# EAGLE design barbi_pozoriste_slave_revb (EAGLE 5.00)
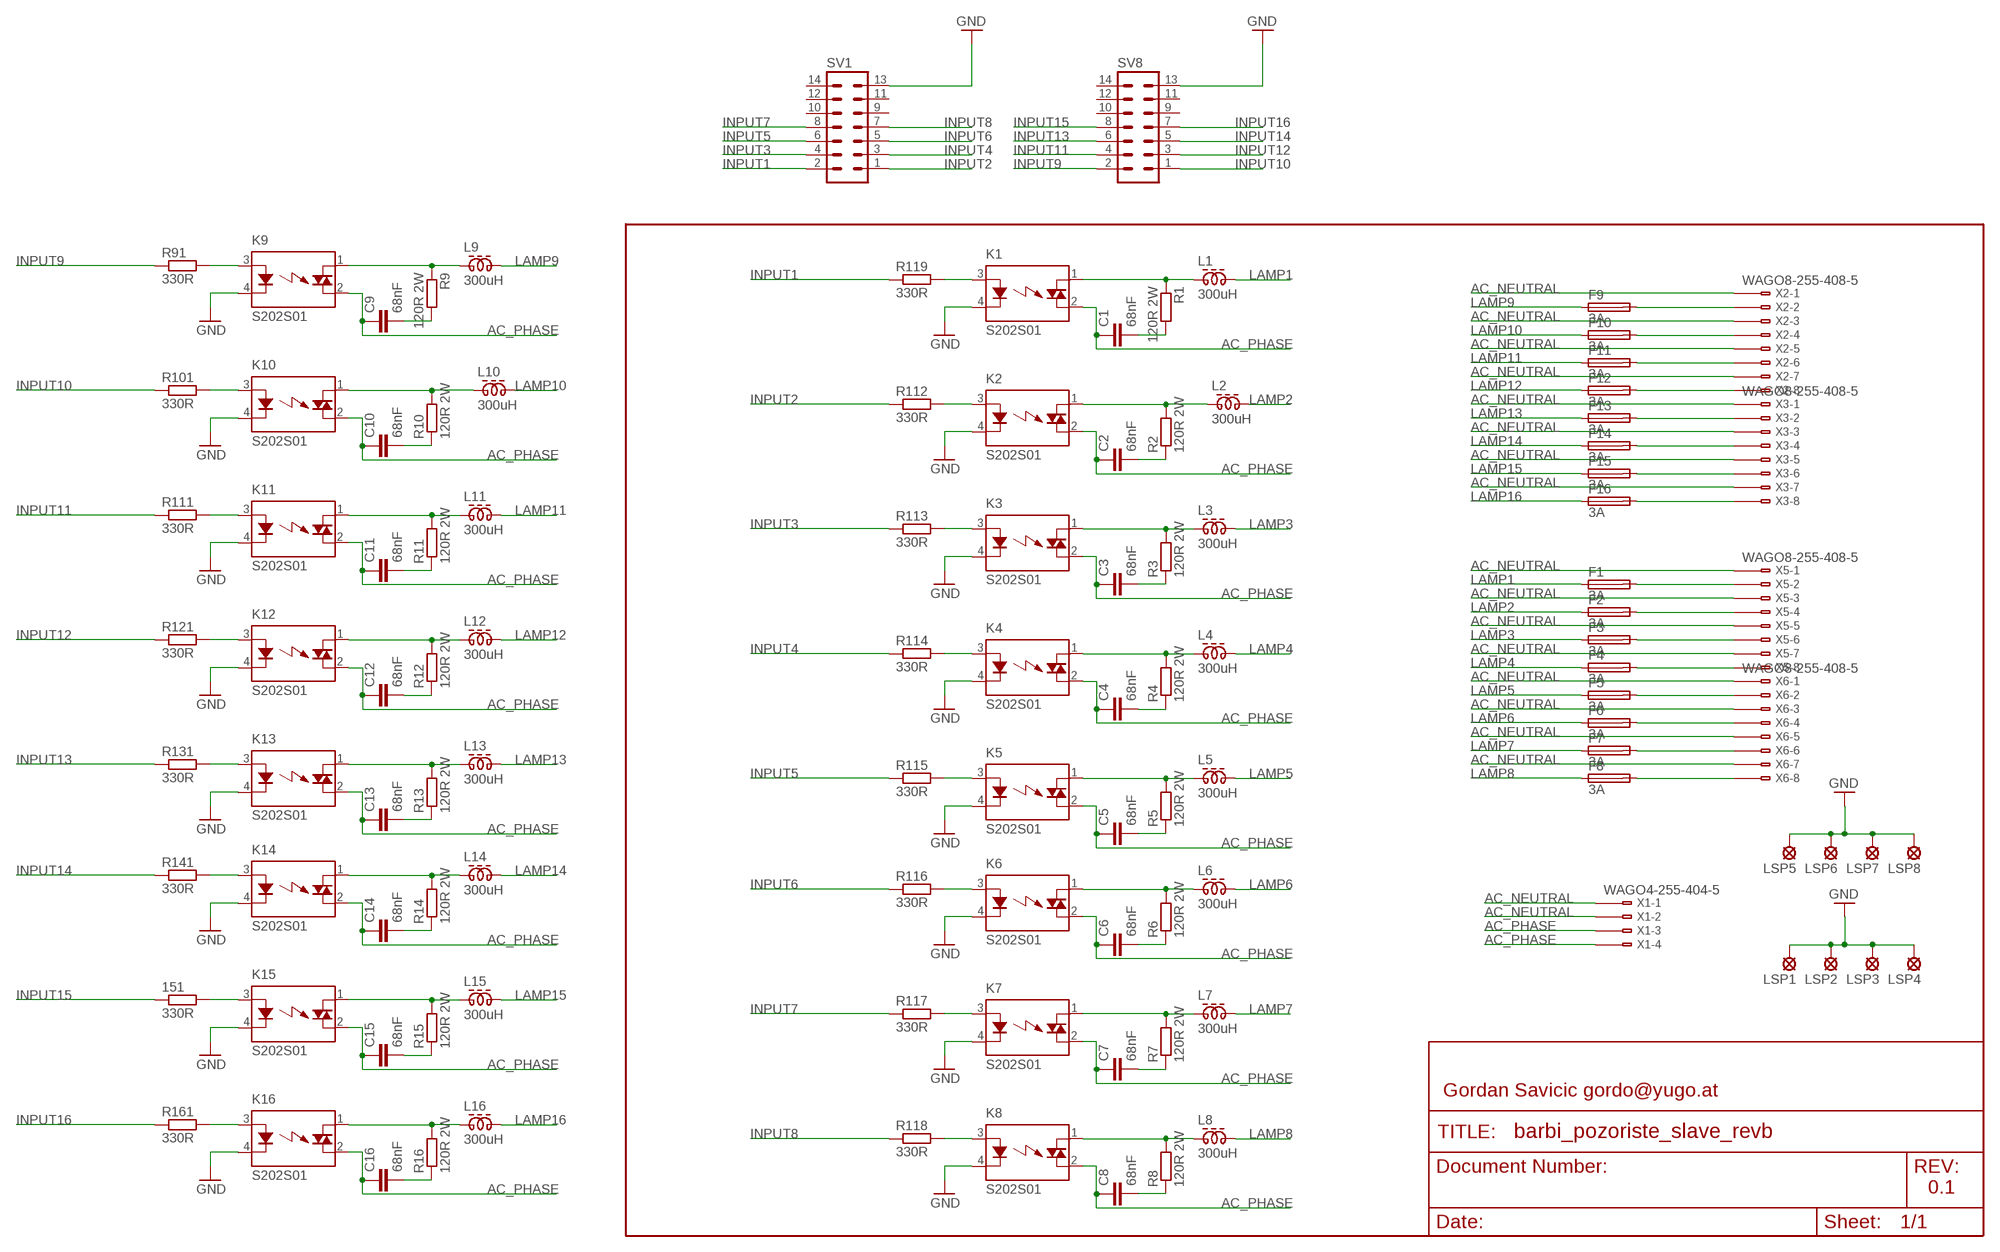
[diagram p0: schematic, sheet 1]

## Parts
151  330R  R-EU_M0805  [M0805]
C1  68nF  C-EU150-064X183  [C150-064X183]
C2  68nF  C-EU150-064X183  [C150-064X183]
C3  68nF  C-EU150-064X183  [C150-064X183]
C4  68nF  C-EU150-064X183  [C150-064X183]
C5  68nF  C-EU150-064X183  [C150-064X183]
C6  68nF  C-EU150-064X183  [C150-064X183]
C7  68nF  C-EU150-064X183  [C150-064X183]
C8  68nF  C-EU150-064X183  [C150-064X183]
C9  68nF  C-EU150-064X183  [C150-064X183]
C10  68nF  C-EU150-064X183  [C150-064X183]
C11  68nF  C-EU150-064X183  [C150-064X183]
C12  68nF  C-EU150-064X183  [C150-064X183]
C13  68nF  C-EU150-064X183  [C150-064X183]
C14  68nF  C-EU150-064X183  [C150-064X183]
C15  68nF  C-EU150-064X183  [C150-064X183]
C16  68nF  C-EU150-064X183  [C150-064X183]
F1  3A  SH22,5  [SH22,5]
F2  3A  SH22,5  [SH22,5]
F3  3A  SH22,5  [SH22,5]
F4  3A  SH22,5  [SH22,5]
F5  3A  SH22,5  [SH22,5]
F6  3A  SH22,5  [SH22,5]
F7  3A  SH22,5  [SH22,5]
F8  3A  SH22,5  [SH22,5]
F9  3A  SH22,5  [SH22,5]
F10  3A  SH22,5  [SH22,5]
F11  3A  SH22,5  [SH22,5]
F12  3A  SH22,5  [SH22,5]
F13  3A  SH22,5  [SH22,5]
F14  3A  SH22,5  [SH22,5]
F15  3A  SH22,5  [SH22,5]
F16  3A  SH22,5  [SH22,5]
K1  S202S01  [S102S01]
K2  S202S01  [S102S01]
K3  S202S01  [S102S01]
K4  S202S01  [S102S01]
K5  S202S01  [S102S01]
K6  S202S01  [S102S01]
K7  S202S01  [S102S01]
K8  S202S01  [S102S01]
K9  S202S01  [S102S01]
K10  S202S01  [S102S01]
K11  S202S01  [S102S01]
K12  S202S01  [S102S01]
K13  S202S01  [S102S01]
K14  S202S01  [S102S01]
K15  S202S01  [S102S01]
K16  S202S01  [S102S01]
L1  300uH  ZD60820512  [ZD6-2W5]
L2  300uH  ZD60820512  [ZD6-2W5]
L3  300uH  ZD60820512  [ZD6-2W5]
L4  300uH  ZD60820512  [ZD6-2W5]
L5  300uH  ZD60820512  [ZD6-2W5]
L6  300uH  ZD60820512  [ZD6-2W5]
L7  300uH  ZD60820512  [ZD6-2W5]
L8  300uH  ZD60820512  [ZD6-2W5]
L9  300uH  ZD60820512  [ZD6-2W5]
L10  300uH  ZD60820512  [ZD6-2W5]
L11  300uH  ZD60820512  [ZD6-2W5]
L12  300uH  ZD60820512  [ZD6-2W5]
L13  300uH  ZD60820512  [ZD6-2W5]
L14  300uH  ZD60820512  [ZD6-2W5]
L15  300uH  ZD60820512  [ZD6-2W5]
L16  300uH  ZD60820512  [ZD6-2W5]
LSP1  MCS08  [MCS08]
LSP2  MCS08  [MCS08]
LSP3  MCS08  [MCS08]
LSP4  MCS08  [MCS08]
LSP5  MCS08  [MCS08]
LSP6  MCS08  [MCS08]
LSP7  MCS08  [MCS08]
LSP8  MCS08  [MCS08]
R1  120R 2W  R-EU_0411/12  [0411/12]
R2  120R 2W  R-EU_0411/12  [0411/12]
R3  120R 2W  R-EU_0411/12  [0411/12]
R4  120R 2W  R-EU_0411/12  [0411/12]
R5  120R 2W  R-EU_0411/12  [0411/12]
R6  120R 2W  R-EU_0411/12  [0411/12]
R7  120R 2W  R-EU_0411/12  [0411/12]
R8  120R 2W  R-EU_0411/12  [0411/12]
R9  120R 2W  R-EU_0411/12  [0411/12]
R10  120R 2W  R-EU_0411/12  [0411/12]
R11  120R 2W  R-EU_0411/12  [0411/12]
R12  120R 2W  R-EU_0411/12  [0411/12]
R13  120R 2W  R-EU_0411/12  [0411/12]
R14  120R 2W  R-EU_0411/12  [0411/12]
R15  120R 2W  R-EU_0411/12  [0411/12]
R16  120R 2W  R-EU_0411/12  [0411/12]
R91  330R  R-EU_M0805  [M0805]
R101  330R  R-EU_M0805  [M0805]
R111  330R  R-EU_M0805  [M0805]
R112  330R  R-EU_M0805  [M0805]
R113  330R  R-EU_M0805  [M0805]
R114  330R  R-EU_M0805  [M0805]
R115  330R  R-EU_M0805  [M0805]
R116  330R  R-EU_M0805  [M0805]
R117  330R  R-EU_M0805  [M0805]
R118  330R  R-EU_M0805  [M0805]
R119  330R  R-EU_M0805  [M0805]
R121  330R  R-EU_M0805  [M0805]
R131  330R  R-EU_M0805  [M0805]
R141  330R  R-EU_M0805  [M0805]
R161  330R  R-EU_M0805  [M0805]
SV1  ML14  [ML14]
SV8  ML14  [ML14]
X1  WAGO4-255-404-5  [255-404-5]
X2  WAGO8-255-408-5  [255-408-5]
X3  WAGO8-255-408-5  [255-408-5]
X5  WAGO8-255-408-5  [255-408-5]
X6  WAGO8-255-408-5  [255-408-5]

## Nets
AC_NEUTRAL: X1.B1(-1:B1) X1.B2(-2:B1) X2.B1(-1:B1) X2.B3(-3:B1) X2.B5(-5:B1) X2.B7(-7:B1) X3.B1(-1:B1) X3.B3(-3:B1) X3.B5(-5:B1) X3.B7(-7:B1) X5.B1(-1:B1) X5.B3(-3:B1) X5.B5(-5:B1) X5.B7(-7:B1) X6.B1(-1:B1) X6.B3(-3:B1) X6.B5(-5:B1) X6.B7(-7:B1)
AC_PHASE: C1.1 C2.1 C3.1 C4.1 C5.1 C6.1 C7.1 C8.1 C9.1 C10.1 C11.1 C12.1 C13.1 C14.1 C15.1 C16.1 K1.2(DS2) K2.2(DS2) K3.2(DS2) K4.2(DS2) K5.2(DS2) K6.2(DS2) K7.2(DS2) K8.2(DS2) K9.2(DS2) K10.2(DS2) K11.2(DS2) K12.2(DS2) K13.2(DS2) K14.2(DS2) K15.2(DS2) K16.2(DS2) X1.B3(-3:B1) X1.B4(-4:B1)
GND: K1.4(K) K2.4(K) K3.4(K) K4.4(K) K5.4(K) K6.4(K) K7.4(K) K8.4(K) K9.4(K) K10.4(K) K11.4(K) K12.4(K) K13.4(K) K14.4(K) K15.4(K) K16.4(K) LSP1.MP LSP2.MP LSP3.MP LSP4.MP LSP5.MP LSP6.MP LSP7.MP LSP8.MP SV1.13 SV8.13
INPUT1: R119.1 SV1.2
INPUT2: R112.1 SV1.1
INPUT3: R113.1 SV1.4
INPUT4: R114.1 SV1.3
INPUT5: R115.1 SV1.6
INPUT6: R116.1 SV1.5
INPUT7: R117.1 SV1.8
INPUT8: R118.1 SV1.7
INPUT9: R91.1 SV8.2
INPUT10: R101.1 SV8.1
INPUT11: R111.1 SV8.4
INPUT12: R121.1 SV8.3
INPUT13: R131.1 SV8.6
INPUT14: R141.1 SV8.5
INPUT15: 151.1 SV8.8
INPUT16: R161.1 SV8.7
LAMP1: F1.1 L1.2
LAMP2: F2.1 L2.2
LAMP3: F3.1 L3.2
LAMP4: F4.1 L4.2
LAMP5: F5.1 L5.2
LAMP6: F6.1 L6.2
LAMP7: F7.1 L7.2
LAMP8: F8.1 L8.2
LAMP9: F9.1 L9.2
LAMP10: F10.1 L10.2
LAMP11: F11.1 L11.2
LAMP12: F12.1 L12.2
LAMP13: F13.1 L13.2
LAMP14: F14.1 L14.2
LAMP15: F15.1 L15.2
LAMP16: F16.1 L16.2
N$1: K2.1(DS1) L2.1 R2.2
N$2: K1.1(DS1) L1.1 R1.1
N$3: C1.2 R1.2
N$4: C2.2 R2.1
N$5: F4.2 X5.B8(-8:B1)
N$6: K3.1(DS1) L3.1 R3.2
N$8: C3.2 R3.1
N$9: F1.2 X5.B2(-2:B1)
N$10: F2.2 X5.B4(-4:B1)
N$11: C4.2 R4.1
N$12: K4.1(DS1) L4.1 R4.2
N$13: K5.1(DS1) L5.1 R5.2
N$15: C5.2 R5.1
N$16: F3.2 X5.B6(-6:B1)
N$17: K6.1(DS1) L6.1 R6.2
N$18: C6.2 R6.1
N$19: F5.2 X6.B2(-2:B1)
N$20: F8.2 X6.B8(-8:B1)
N$21: C7.2 R7.1
N$22: K7.1(DS1) L7.1 R7.2
N$23: K8.1(DS1) L8.1 R8.2
N$24: C8.2 R8.1
N$25: F7.2 X6.B6(-6:B1)
N$26: F6.2 X6.B4(-4:B1)
N$27: K2.3(A) R112.2
N$28: K3.3(A) R113.2
N$29: K4.3(A) R114.2
N$30: K5.3(A) R115.2
N$31: K6.3(A) R116.2
N$32: K7.3(A) R117.2
N$33: K8.3(A) R118.2
N$34: K1.3(A) R119.2
N$36: K10.3(A) R101.2
N$38: K11.3(A) R111.2
N$40: K12.3(A) R121.2
N$42: K13.3(A) R131.2
N$44: K14.3(A) R141.2
N$46: 151.2 K15.3(A)
N$48: K16.3(A) R161.2
N$50: K9.3(A) R91.2
N$59: K9.1(DS1) L9.1 R9.1
N$60: C9.2 R9.2
N$61: K10.1(DS1) L10.1 R10.2
N$62: C10.2 R10.1
N$63: K11.1(DS1) L11.1 R11.2
N$64: C11.2 R11.1
N$65: C12.2 R12.1
N$66: K12.1(DS1) L12.1 R12.2
N$67: K13.1(DS1) L13.1 R13.2
N$68: C13.2 R13.1
N$69: K14.1(DS1) L14.1 R14.2
N$70: C14.2 R14.1
N$71: C15.2 R15.1
N$72: K15.1(DS1) L15.1 R15.2
N$73: K16.1(DS1) L16.1 R16.2
N$74: C16.2 R16.1
N$139: F12.2 X2.B8(-8:B1)
N$140: F9.2 X2.B2(-2:B1)
N$141: F10.2 X2.B4(-4:B1)
N$142: F11.2 X2.B6(-6:B1)
N$143: F13.2 X3.B2(-2:B1)
N$144: F16.2 X3.B8(-8:B1)
N$145: F15.2 X3.B6(-6:B1)
N$146: F14.2 X3.B4(-4:B1)
Unconnected: SV1.9 SV1.10 SV1.11 SV1.12 SV1.14 SV8.9 SV8.10 SV8.11 SV8.12 SV8.14 X1.A1(-1:A1) X1.A2(-2:A1) X1.A3(-3:A1) X1.A4(-4:A1) X2.A1(-1:A1) X2.A2(-2:A1) X2.A3(-3:A1) X2.A4(-4:A1) X2.A5(-5:A1) X2.A6(-6:A1) X2.A7(-7:A1) X2.A8(-8:A1) X3.A1(-1:A1) X3.A2(-2:A1) X3.A3(-3:A1) X3.A4(-4:A1) X3.A5(-5:A1) X3.A6(-6:A1) X3.A7(-7:A1) X3.A8(-8:A1) X5.A1(-1:A1) X5.A2(-2:A1) X5.A3(-3:A1) X5.A4(-4:A1) X5.A5(-5:A1) X5.A6(-6:A1) X5.A7(-7:A1) X5.A8(-8:A1) X6.A1(-1:A1) X6.A2(-2:A1) X6.A3(-3:A1) X6.A4(-4:A1) X6.A5(-5:A1) X6.A6(-6:A1) X6.A7(-7:A1) X6.A8(-8:A1)

## Notes on the sheet
- Gordan Savicic gordo@yugo.at
- 0.1

## Library data of the parts
151 R1-R16 R91 R101 R111-R119 R121 R131 R141 R161 = rcl:R-EU_: RESISTOR, European symbol
C1-C16 = rcl:C-EU: CAPACITOR, European symbol
F1-F16 = fuse:SH22,5: FUSE HOLDER grid 22,5 mm, OGN0031 8201, Schurter (Buerklin)
K1-K16 = relay:S?*: Low Height Type Solid State Relays SHARP Source: 162574-da-01-en-S202T02_Solid_State_Relais.pdf Source: http://sharp-world.com .. s102s11_e.pdf
L1-L16 = inductor-neosid:ZD60820512: WIDE-BAND CHOKE 2.5 windings
LSP1-LSP8 = solpad:MCS08: SOLDER PAD MC S0,8, drill 1.2 mm, distributor Buerklin, 08F130
SV1 SV8 = con-ml:ML14: HARTING
X1 = con-wago:WAGO4-: WAGO Cage Clamp
X2 X3 X5 X6 = con-wago:WAGO8-: WAGO Cage Clamp

## Board
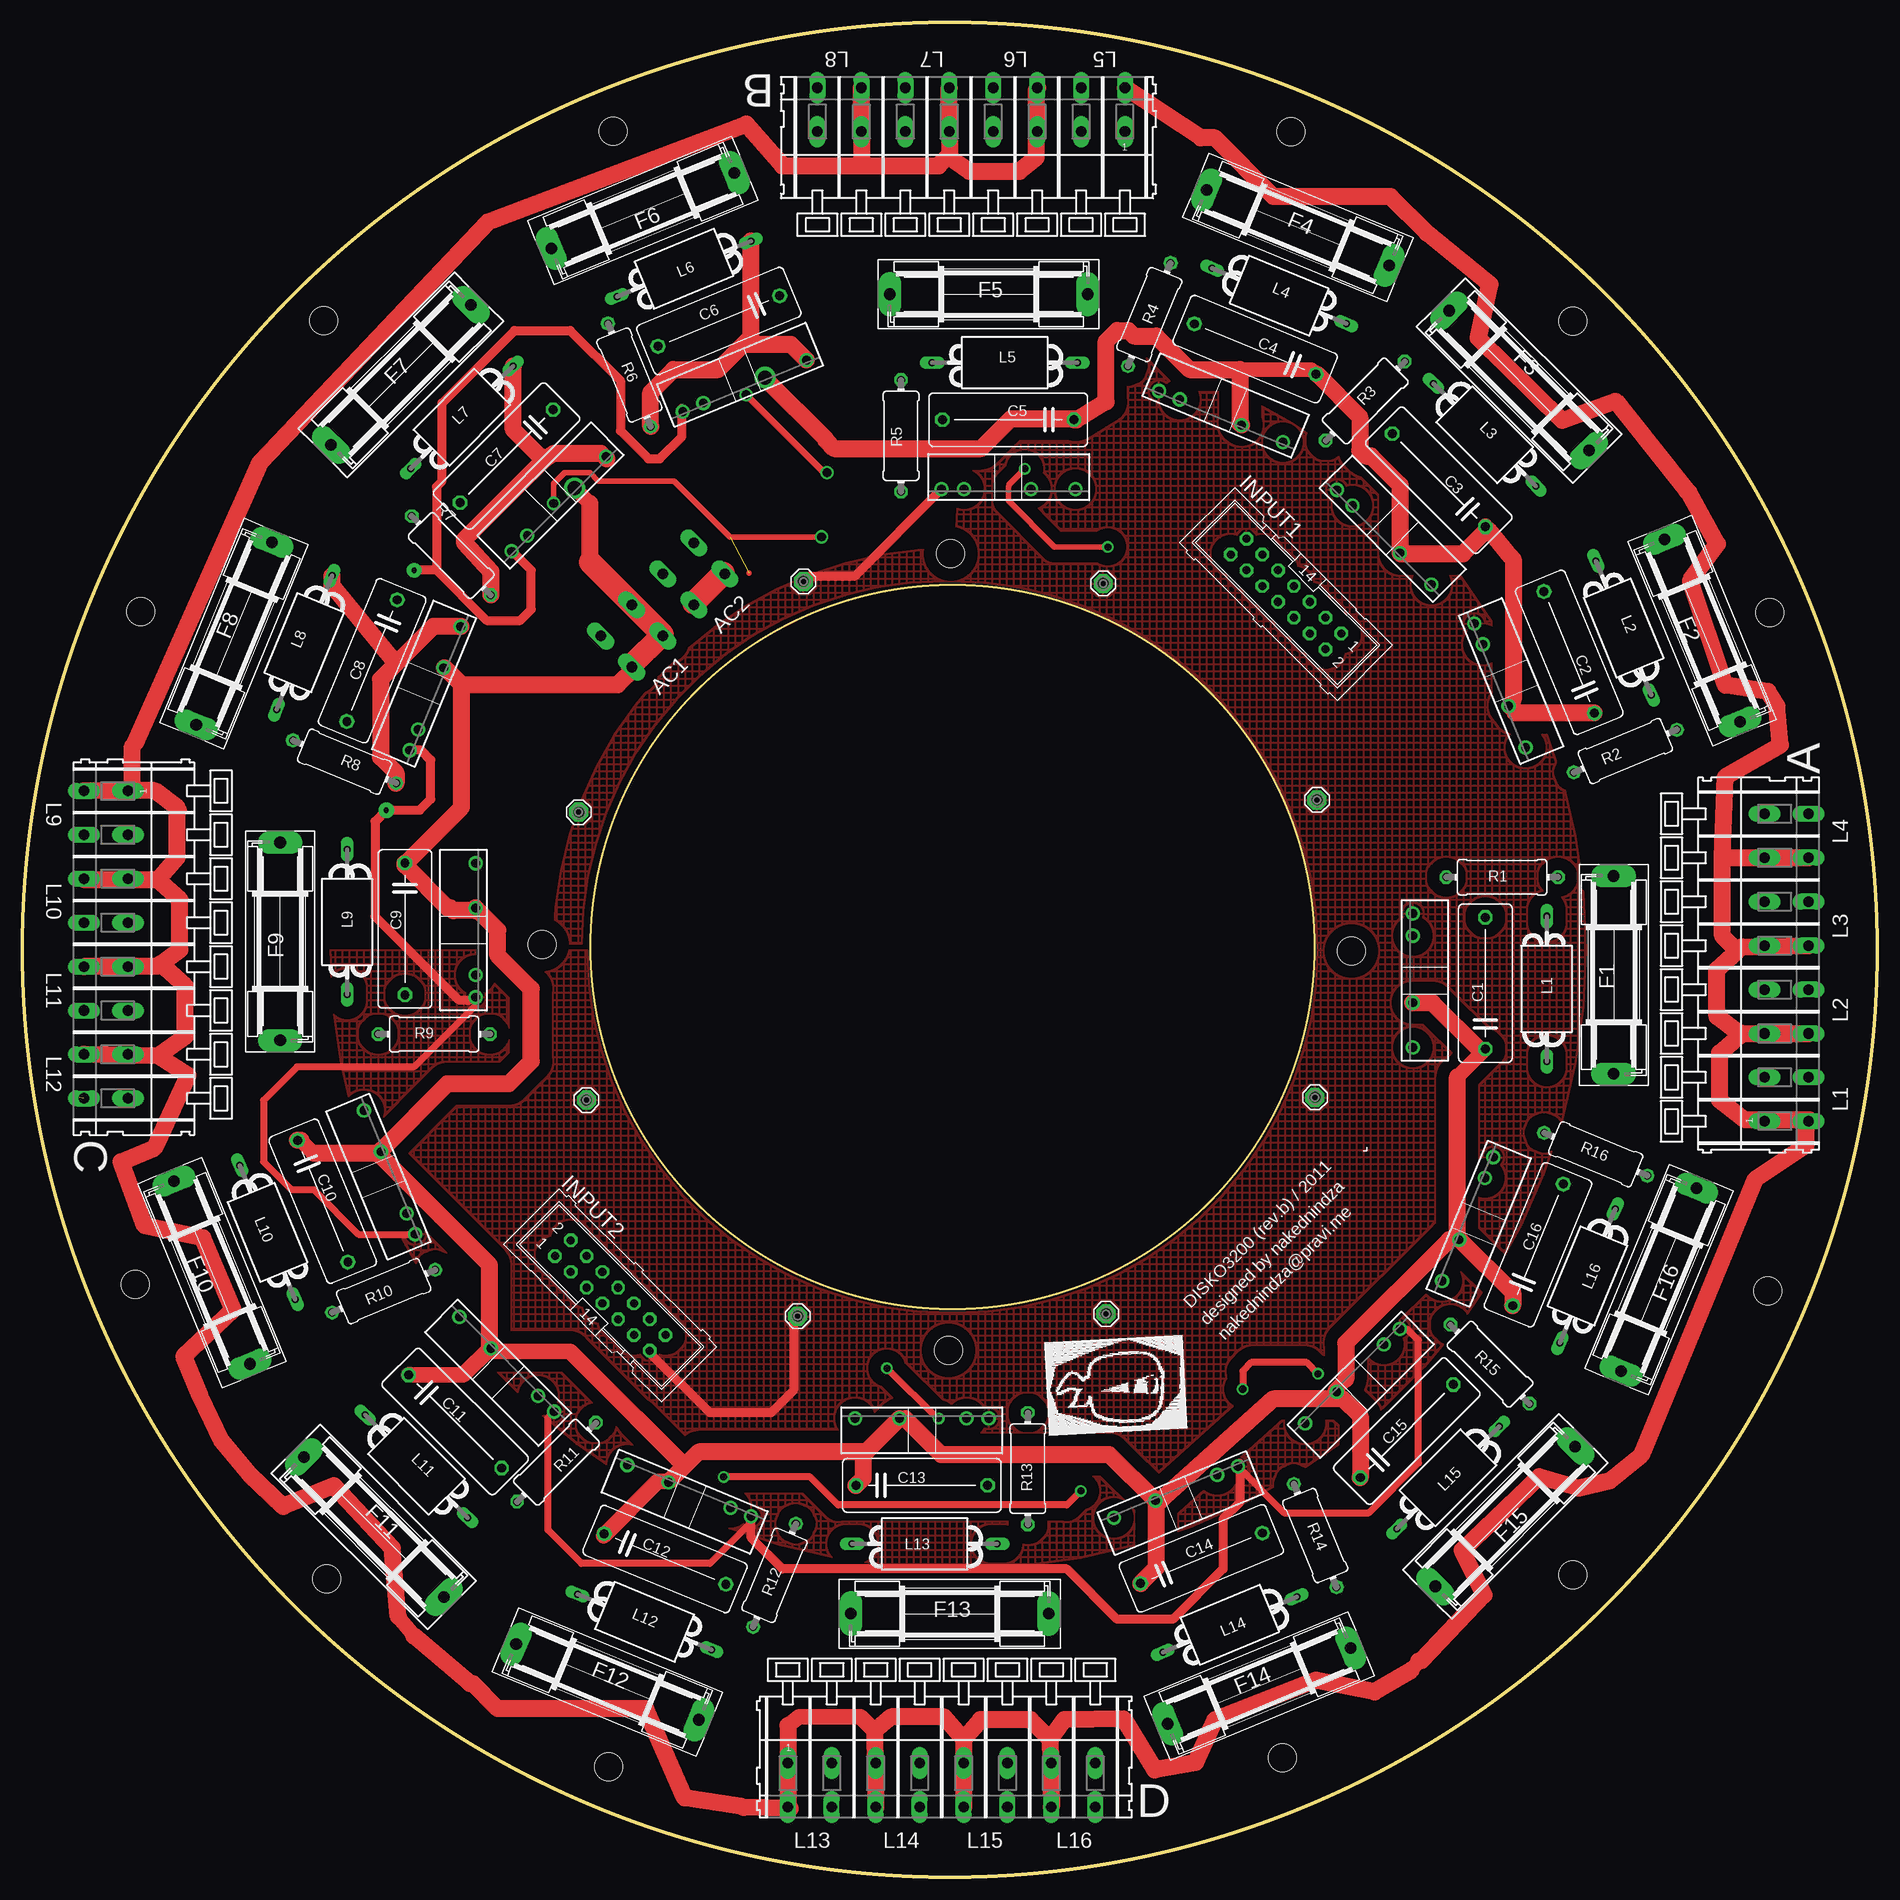
[diagram p1: board, top side]
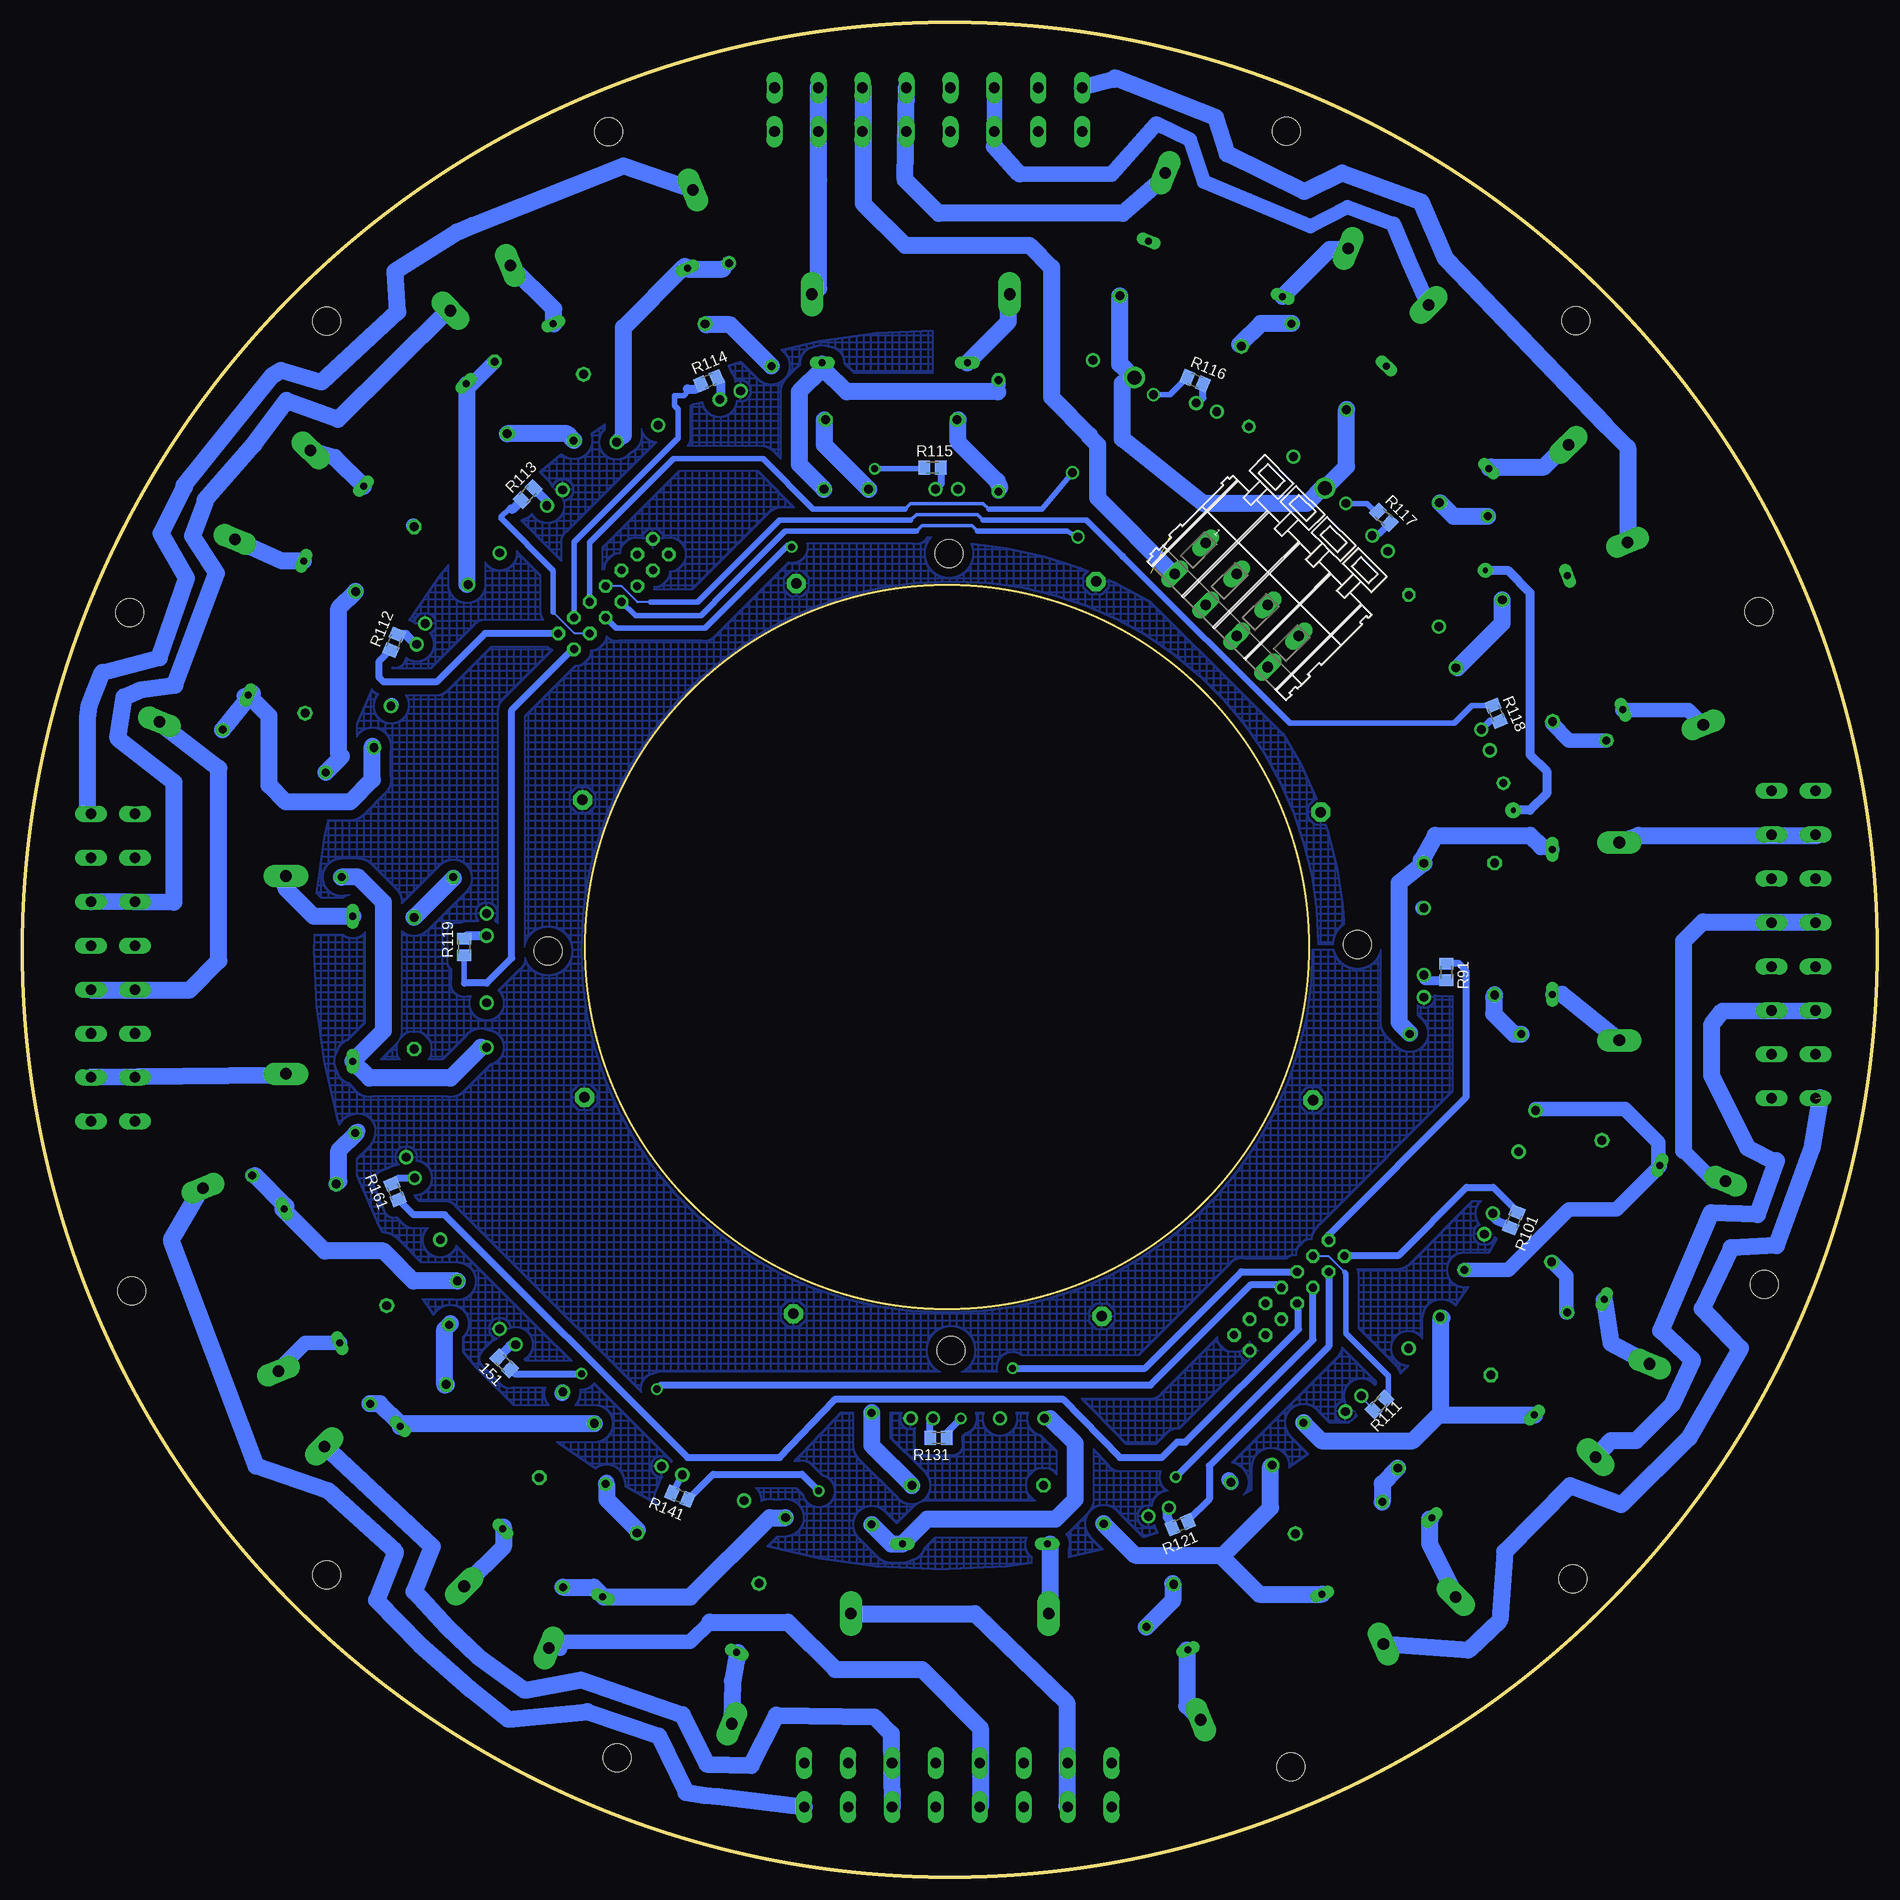
[diagram p2: board, bottom side, seen from below]

No outline drawn. Coordinates in mm, seen from the top.
Copper layers (1*16): Top 0.035mm / dielectric 1.5mm / Bottom 0.035mm
Design rules "SparkFun": minimum track width 8mil, minimum drill 20mil, track to track 8mil, track to pad 8mil, pad to pad 8mil, via to via 8mil, smd to smd 8mil, copper to edge 10mil, drill to drill 8mil, minimum pad ring 12mil, minimum via ring 10mil, stop-mask expansion 4mil, vias tented up to drill 25mil, thermal gap 10mil
Holes 3.2 mm at -46.41,0.59 45.7,-0.16 -0.13,-45.59 0.11,45.06 -92.06,38.48 93.09,-38.83 -38.86,-92.99 37.87,-91.95 -38.32,93.13 38.83,93.13 -92.7,-38.11 93.34,38.35 -71.23,71.61 -70.9,-71.57 70.9,-71.14 70.94,71.52
Milling: area -40.9,-40.9 to 41.5,41.5; area -105.4,-105.4 to 105.4,105.4; area -105.6,-105.6 to 105.6,105.6

### Footprints (pad centres in the part's own frame; a part is rotated, then mirrored left to right if it is on the bottom)
M0805 = smd 1.3 x 1.6: 1 -0.95,0; 2 0.95,0
C150-064X183 = drill 1.016 octagon: 1 -7.493,0; 2 7.493,0
SH22,5 = drill 1.321 pad 2.54 long: 1 -11.252,0; 2 11.252,0
S102S01 = drill 1 round: 1 -7.62,0; 2 -2.54,0; 3 5.08,0; 4 7.62,0
ZD6-2W5 = drill 0.8 long: 1 -8.255,0; 2 8.255,0
MCS08 = drill 1.194 pad 2.159 octagon: MP 0,0
0411/12 = drill 0.914 octagon: 1 -6.35,0; 2 6.35,0
ML14 = drill 0.914 octagon: 1 -7.62,-1.27; 2 -7.62,1.27; 3 -5.08,-1.27; 4 -5.08,1.27; 5 -2.54,-1.27; 6 -2.54,1.27; 7 0,-1.27; 8 0,1.27; 9 2.54,-1.27; 10 2.54,1.27; 11 5.08,-1.27; 12 5.08,1.27; 13 7.62,-1.27; 14 7.62,1.27
255-404-5 = drill 1.2 long: A1 -7.5,0; A2 -2.5,0; A3 2.5,0; A4 7.5,0; B1 -7.5,-5; B2 -2.5,-5; B3 2.5,-5; B4 7.5,-5
255-408-5 = drill 1.2 long: A1 -17.5,0; A2 -12.5,0; A3 -7.5,0; A4 -2.5,0; A5 2.5,0; A6 7.5,0; A7 12.5,0; A8 17.5,0; B1 -17.5,-5; B2 -12.5,-5; B3 -7.5,-5; B4 -2.5,-5; B5 2.5,-5; B6 7.5,-5; B7 12.5,-5; B8 17.5,-5

### Placement (x,y rotation side)
151  50.71,-47.08 135 bottom
C1  60.96,-3.81 90 top
C2  70.5,33.85 112.5 top
C3  55.66,53.43 135 top
C4  34.76,68.36 157.5 top
C5  6.65,60.32 180 top
C6  -26.28,71.56 202.5 top
C7  -50.44,56.18 225 top
C8  -65.75,32.9 247.5 top
C9  -62.01,2.37 270 top
C10  -71.36,-28.62 292.5 top
C11  -56.29,-53.7 315 top
C12  -32.41,-69.34 337.5 top
C13  -3.17,-60.96 0 top
C14  28.64,-69.26 22.5 top
C15  52.01,-54.78 45 top
C16  66.95,-33.58 67.5 top
F1  75.56,-2.86 270 top
F2  85.64,36.33 292.5 top
F3  64.79,64.78 135 top
F4  39.61,82.19 157.5 top
F5  4.43,74.61 0 top
F6  -34.92,84.12 22.5 top
F7  -62.45,65.42 45 top
F8  -81.45,35.98 67.5 top
F9  -76.2,0.95 90 top
F10  -83.97,-36.74 112.5 top
F11  -65.55,-65.69 135 top
F12  -38.96,-83.33 157.5 top
F13  0,-75.56 0 top
F14  35.22,-83.79 22.5 top
F15  63.23,-64.49 45 top
F16  80.7,-37.55 67.5 top
K1  52.7,-3.49 90 top
K2  62.63,30.07 112.5 top
K3  49.44,46.96 135 top
K4  30.86,60.69 157.5 top
K5  6.69,52.42 180 top
K6  -23.35,64.17 202.5 top
K7  -44.49,50.74 225 top
K8  -58.57,29.74 247.5 top
K9  -53.98,2.22 270 top
K10  -63.77,-25.33 292.5 top
K11  -50.43,-47.18 315 top
K12  -29.65,-61.57 337.5 top
K13  -3.17,-53.34 0 top
K14  25.74,-61.72 22.5 top
K15  45.83,-48.52 45 top
K16  58.95,-30.65 67.5 top
L1  67.94,-4.45 90 top
L2  76.69,36.61 112.5 top
L3  60.88,58.61 315 top
L4  37.49,74.42 337.5 top
L5  6.26,66.82 180 top
L6  -30.25,77.5 202.5 top
L7  -55.52,60.6 225 top
L8  -73.47,34.95 247.5 top
L9  -68.58,3.17 270 top
L10  -77.65,-32.16 292.5 top
L11  -60.7,-58.79 315 top
L12  -34.73,-76.49 337.5 top
L13  -2.86,-67.63 180 top
L14  31.87,-76.81 202.5 top
L15  56.7,-60.08 225 top
L16  72.58,-37.12 247.5 top
LSP1  -41.34,-17.12 0 top
LSP2  -17.31,-41.7 0 top
LSP3  17.8,-41.44 0 top
LSP4  41.58,-16.8 0 top
LSP5  -42.23,15.66 0 top
LSP6  -16.65,41.92 0 top
LSP7  17.46,41.69 0 top
LSP8  41.8,17.05 0 top
R1  62.87,8.26 180 top
R2  76.89,22.61 22.5 top
R3  47.29,62.45 45 top
R4  22.71,72.29 67.5 top
R5  -5.55,58.49 90 top
R6  -36.47,65.41 292.5 top
R7  -56.74,44.86 315 top
R8  -68.87,21.4 337.5 top
R9  -58.69,-9.6 180 top
R10  -64.43,-38.86 22.5 top
R11  -44.75,-58.33 45 top
R12  -19.95,-71.2 67.5 top
R13  8.89,-59.05 270 top
R14  41.6,-66.67 292.5 top
R15  61.49,-47.18 315 top
R16  73.51,-23.28 337.5 top
R91  -56.52,-2.54 270 bottom
R101  -64.21,-30.75 247.5 bottom
R111  -48.9,-51.75 225 bottom
R112  63.23,35 67.5 bottom
R113  48.04,51.85 45 bottom
R114  27.43,64.75 22.5 bottom
R115  1.95,54.86 0 bottom
R116  -27.94,64.77 337.5 bottom
R117  -49.4,49.21 315 bottom
R118  -62.18,26.91 292.5 bottom
R119  55.24,0.32 90 bottom
R121  -26.23,-65.43 202.5 bottom
R131  1.27,-55.56 180 bottom
R141  30.72,-62.18 157.5 bottom
R161  63.14,-27.55 112.5 bottom
SV1  38.27,40.49 135 top
SV8  -38.64,-39.35 315 top
X1  -34.43,41.01 315 bottom
X2  -93.54,0.59 270 top
X3  -0.93,-92.56 0 top
X5  92.75,-2.03 90 top
X6  2.44,93.1 180 top

### Tracks (layer width: path | path; a pad name or v marks a point on that pad's centre or on a via)
AC_NEUTRAL
  Top 1.676: -87.95,16.19 -87.63,15.88 | -0.32,90.17 0,90.17 | -10.16,89.22 -10.16,89.38 -10,89.22 | -25.72,42.86 -25.64,42.78 X1.B1 | -29.13,39.45 X1.B2 | X3.B1 -18.16,-97.71 | 53.34,-80.96 52.54,-81.99 | -60.96,-78.11 -62.77,-75.91 | 84.14,52.07 83.87,52.24 | 10.16,98.11 | 10.16,98.11 X6.B3 | 9.84,97.79 10.16,98.11
  Top 1.778: -98.42,7.94 X2.B3 | -90.17,-1.91 -89.81,-1.64 -89.85,-1.59 | -18.73,-97.47 X3.B1 -18.41,-97.47 | -8.57,-88.9 -10.16,-87.31 -17.14,-87.31 -18.41,-88.27 | 97.47,-19.68 X5.B1 97.79,-19.37 | 90.17,-9.53 89.99,-9.68 89.85,-9.53 | 90.17,0.32 89.66,-0.14 89.53,0 | -10.16,89.22 -10,89.22 | -93.03,18.09 | -93.03,23.18 -92.71,23.5
  Top 1.93: -60.96,-78.11 -54.61,-83.5 -54.29,-83.5 -51.44,-86.36 -34.61,-86.36 -30.16,-96.52 -23.81,-97.47 -23.46,-97.6 -18.16,-97.71 | X2.B1 -93.03,18.09 -90.49,18.1 -87.95,16.19 -87.95,10.48 -90.17,7.94 | -90.17,7.94 -98.42,7.94 | -90.17,-1.91 X2.B5 | -89.81,-1.64 -87.63,0 -87.63,5.71 -90.17,7.94 | -90.17,-12.06 X2.B7 | -90.17,-12.06 -87,-9.84 -87,-4.13 -89.85,-1.59 | -90.17,-12.06 -86.68,-14.29 -90.49,-22.54 -94.3,-24.13 -91.6,-31.43 -85.02,-32.79 -81.55,-40.98 -87.16,-46.26 -85.31,-50.76 -82.87,-55.88 -79.69,-59.69 -75.85,-63.35 -70.11,-61 -63.43,-68.11 -62.77,-75.91 | X3.B3 -8.57,-88.9 -6.67,-87.31 -0.64,-87.31 1.59,-89.85 | -18.41,-88.27 -18.41,-97.47 | 1.59,-89.85 X3.B5 | 11.43,-89.85 X3.B7 | 11.43,-89.85 9.21,-87.63 3.49,-87.63 1.59,-89.85 | 11.43,-89.85 13.02,-87.63 19.8,-87.54 23.34,-93.34 27.97,-92.51 30.16,-87.64 41.69,-83.13 48.34,-84.46 52.54,-81.99 | 97.47,-19.68 97.47,-22.23 91.76,-26.04 78.74,-57.47 75.16,-60.4 71.58,-61.26 67.09,-59.94 58.3,-68.33 60.8,-73.44 53.68,-80.92 53.34,-80.96 | 90.17,-9.53 X5.B3 | 89.99,-9.68 87.63,-11.75 87.63,-17.14 90.49,-19.37 97.79,-19.37 | 90.17,0.32 X5.B5 | 89.66,-0.14 87.31,-2.22 87.31,-7.62 89.85,-9.53 | X5.B7 90.17,10.48 87.95,10.48 | 87.95,10.48 87.95,1.59 89.53,0 | X6.B5 0,90.17 2.22,88.58 7.94,88.58 9.84,90.17 9.84,97.79 | X6.B1 28.57,92.39 30.16,92.39 36.83,85.72 50.16,85.72 54.29,81.6 61.47,75.74 60.14,69.63 69.69,60.23 75.8,62.42 83.87,52.24 | 87.95,10.48 88.27,19.68 94.54,23.3 94.15,27.73 93.11,29.39 88.29,30.11 84.3,42.01 87.37,46.19 84.14,52.07 | X6.B7 -10,89.22 -1.27,89.22 -0.32,90.17 | -10.16,89.22 -19.05,89.22 -23.18,93.98 -52.56,82.83 -78.42,55.56 -92.71,23.5
  Top 1.93: -93.03,18.09 -93.03,23.18
  Top 2.54: -25.72,42.86 -29.13,39.45
  Bottom 1.676: -15.88,58.42 -15.92,58.47 -15.92,58.53 | -25.48,42.78 X1.B1 | 9.84,98.11 9.85,98.11 X6.B3
  Bottom 1.93: -15.92,58.53 -11.59,62.87 -11.59,77.63 -9.05,80.17 5.08,80.17 9.84,84.93 9.84,98.11 | -15.88,58.42 -16.83,57.47 -16.83,51.44 -25.48,42.78
AC_PHASE  (via drill 1.6 pad 1.02, 1.6 pad 1.93)
  Top 1.676: 57.78,-14.48 C1.1 60.2,-11.3 | K16.2 57.78,-32.8 | -9.53,-57.15 -9.84,-57.15 | K12.2 -32.07,-60.53 -32.07,-60.33 -31.75,-60.33 | -5.08,-53.34 K13.2 | K14.2 23.5,-62.79 23.89,-62.79 | C12.1 -39.21,-66.36 | 41.59,65.72 41.59,65.58 C4.1 | 14.46,60.33 13.97,60.33 | K3.2 51.31,45.09 | C3.1 60.96,48.26 | C3.1 61.28,47.81 | 60.96,47.62 C3.1 | 64.14,28.45 K2.2 64.33,26.99 | 63.82,44.77 64.14,44.45 | 73.34,26.99 73.34,26.95 C2.1 | 44.77,-51.12 44.03,-50.38 K15.2 43.97,-50.32 43.81,-50.16 45.09,-48.9 | 56.85,-33 K16.2 | K16.2 58.08,-33 | C4.1 41.82,65.5 | -72.39,-23.18 -73.87,-21.7 | -64.77,-23.5 -64.77,-23.18 -64.74,-23.14 K10.2 -64.74,-22.83 | -52.09,-45.38 -52.07,-45.4 | K11.2 -52.09,-45.38 | -52.09,-45.38 -52.39,-45.09 | -62.01,9.62 C9.1 | -56.83,4.76 -57.15,4.76 | -57.49,32.09 K8.2 | -36.2,32.38 X1.B4 -35.98,32.17 -35.88,32.07 | -40.96,50.8 K7.2 | -32.7,35.88 -32.66,35.84 X1.B3 | v-21,65.13 -21,64.99 | -14.1,58.09 -14.1,57.99 | 14.19,60.44 14.15,60.39 C5.1 | C4.1 41.68,65.51 41.15,66.04 33.02,66.04
  Top 1.778: -52.22,-45.24 -52.07,-45.09 | -52.22,-45.24 K11.2 -52.22,-45.57 -52.07,-45.72 -43.18,-45.72 -35.56,-53.34 | C11.1 -55.38,-48.4 -52.22,-45.24 | -39.33,-66.63 -39.37,-66.67 | -39.33,-66.63 C12.1 | -32.07,-60.53 -33.23,-60.53 -39.33,-66.63
  Top 1.93: 57.78,-32.8 57.78,-14.48 | K13.2 -9.53,-57.15 | -30.16,-58.74 -28.57,-57.15 -9.84,-57.15 -9.84,-60.13 C13.1 | -30.16,-58.74 -31.75,-60.33 | K14.2 18.17,-57.47 -0.95,-57.47 -5.08,-53.34 | C14.1 23.5,-70.35 23.5,-62.79 | C5.1 14.46,60.33 17.78,62.37 17.78,69.22 19.05,70.48 20.32,70.48 20.95,69.85 23.5,69.85 27.3,66.04 33.02,66.04 33.02,59.91 K4.2 | 51.31,45.09 58.42,45.09 60.96,47.62 | 61.28,47.81 63.82,44.77 | 64.14,44.45 64.14,28.45 | 64.33,26.99 73.34,26.99 | 23.89,-62.79 36.83,-51.12 44.77,-51.12 46.71,-53.06 C15.1 | 56.85,-33 45.09,-44.77 45.09,-48.9 | C16.1 64.08,-39 58.08,-33 | 60.2,-11.3 54.93,-6.03 K1.2 | K3.2 51.23,52.91 47.94,56.2 47.31,56.2 46.67,56.83 46.67,60.64 41.82,65.5 | -73.87,-21.7 C10.1 | -64.77,-23.18 -72.39,-23.18 | -64.77,-23.5 -52.39,-35.88 -52.39,-45.09 | -57.15,4.76 -62.01,9.62 | C9.1 -62.01,9.75 -55.56,16.19 -55.56,30.16 | -55.56,30.16 -57.49,32.09 | -55.56,30.16 -37.78,30.16 -35.88,32.07 | -40.96,44.13 -40.96,50.8 | -21,64.99 -14.1,58.09 | -14.1,57.99 -13.16,57.05 3.57,57.05 6.96,60.44 14.19,60.44 | -64.74,-22.83 -57.15,-15.24 -50.16,-15.24 -47.62,-12.7 -47.62,-4.45 -51.44,-0.64 -51.44,2.22 K9.2 -53.98,4.45 -56.52,4.45 -56.83,4.76 | -30.16,-58.74 -35.56,-53.34
  Top 2.54: -36.2,32.38 -32.7,35.88 -40.96,44.13
  Bottom 1.676: C3.1 61.08,48.26 | 14.29,60.33 C5.1 | K2.2 63.5,27.82 | K9.2 -53.82,4.76 | K7.2 | -20.95,65.09 v-21,65.13 K6.2 | -57.78,32.07 -57.76,32.09 K8.2 | -42.55,52.7 -42.69,52.56 K7.2 | -20.86,65.14 -20.77,65.23 | -20.86,65.14 K6.2 | -19.64,64.46 -20.86,65.14 | -20.86,65.14 | -20.86,65.14 -20.87,65.14 K6.2
  Bottom 1.778: K12.2 -31.75,-60.33 | K15.2 44.13,-50.48
  Bottom 1.93: K5.2 14.29,57.48 14.29,60.33 | C7.1 -45.15,54.99 K7.2 | C8.1 -62.88,37.16 -57.78,32.07 | -42.55,52.7 -40.64,50.8 -28.89,50.8 -19.64,58.15 -19.64,64.46 | C6.1 -19.36,66.64 -20.86,65.14
  other vias: -42.69,52.53
GND  (via drill 0.6 pad 1.68, 0.6 pad 1.78)
  Top 0.813: K14.4 38.11,-64.14 47.62,-64.14 53.34,-58.42 53.34,-44.45 52.07,-43.18 51.17,-43.18 | 51.17,-43.18 50.8,-43.18 | 51.17,-43.18 K15.4 | K11.4 -45.72,-53.24 -45.72,-66.04 -41.91,-69.85 -27.3,-69.85 -22.86,-65.41 -22.86,-64.74 K12.4 | K10.4 -60.87,-32.38 -67.31,-32.38 -72.39,-27.3 -74.93,-27.3 -78.11,-24.13 -78.11,-17.14 -74.3,-13.34 -60.96,-13.34 -53.98,-6.35 K9.4 -53.98,-5.08
  Top 1.016: SV8.13 -34.15,-45.86 -27.3,-52.7 -20.32,-52.7 -17.78,-50.16 -17.78,-42.55 -17.14,-41.91 -17.3,-41.75 LSP2.MP | K12.4 -22.61,-66.92 -19.05,-70.48 13.34,-70.48 19.05,-76.2 25.4,-76.2 31.11,-70.48 31.11,-64.77 33.02,-62.87 33.02,-58.42 32.78,-58.66 K14.4 | K7.4 -49.8,45.35 -47.62,43.18 -47.62,38.73 -48.9,37.47 -52.7,37.47 -58.42,43.18 | -58.42,43.18 -58.42,52.7 -57.78,53.34 -57.78,62.23 -49.53,70.48 -43.18,70.48 -37.47,64.77 -37.47,59.05 -34.29,55.88 -33.02,55.88 -30.48,58.42 -30.48,61.59 -30.39,61.5 K6.4 | -53.98,-5.08 -54.61,-5.71 -55.88,-5.71 -65.41,3.81 -65.41,14.61 v-64.14,15.88 -60.33,15.88 -59.05,17.14 -59.05,21.59 -60.17,22.7 K8.4 | -58.42,43.18 v-60.96,43.18 | K5.4 -0.93,52.41 -10.79,42.55 -15.88,42.55 -16.51,41.91 -16.52,41.92 LSP6.MP
  Bottom 0.813: LSP5.MP -42.55,15.88
  Bottom 1.016: v-60.96,43.18 -63.5,43.18 -66.04,40.64 -66.04,22.23 -67.94,20.32 -67.94,17.78 -66.04,15.88 v-64.14,15.88
  pour Bottom (isolate 1.016, hatched): -45.09,0.64 arc-90 1.91,46.35 1.91,70.48 arc-90 72.39,0 arc-90 1.91,-70.48 0,-70.48 arc-90 -70.48,0 -41.27,0 arc90 0,-41.27 0.64,-41.27 arc90 41.91,0 arc90 0,41.91 -0.64,41.91 arc90 -41.91,0.64
  pour Top (isolate 1.422, hatched): -45.09,0.64 arc-90 0.64,45.72 1.91,70.48 arc-90 72.39,0 arc-90 1.91,-70.48 0,-70.48 arc-90 -70.48,0 -41.27,0 arc90 0,-41.27 0.64,-41.27 arc90 41.91,0 arc90 0,41.91 -0.64,41.91 arc90 -41.91,0.64
INPUT1
  Bottom 0.61: 55.24,-3.81 R119.1
  Bottom 0.813: SV1.2 42.95,34.21 49.85,27.3 49.85,-0.95 52.7,-3.81 55.24,-3.81
INPUT2
  Bottom 0.61: 64.94,30.96 64.92,30.96
  Bottom 0.813: SV1.1 52.9,36 58.42,30.48 64.45,30.48 64.94,30.96 | R112.1 63.63,34.16 64.92,32.87 64.92,30.96
INPUT3
  Bottom 0.254: SV1.4 42.72,36 45.12,38.41
  Bottom 0.61: 51.05,49.1 51.07,49.09 | 45.12,38.41 45.12,43.17 51.05,49.1 | 49.9,50.16 50.16,50.16 51.05,49.28 51.05,49.1
  Bottom 1.016: R113.1 49.72,50.16 49.9,50.16
INPUT4
  Bottom 0.61: SV1.3 42.76,46.4 30.93,58.23 30.93,61.54 31.32,61.92 31.32,63.06 31.29,63.09 30.26,63.09 29.84,63.5 29.85,63.51 29.85,63.82
  Bottom 1.016: R114.1 28.87,63.82 29.85,63.82
INPUT5  (via drill 0.8 pad 1.02)
  Top 0.61: v8.55,54.75 6.72,52.92 6.72,52.76 6.67,52.7 6.67,51.12 11.94,45.84 v17.99,45.84
  Bottom 0.61: SV1.6 37.97,36.61 27.86,36.61 22.05,42.41 22.04,42.41 18.41,46.04 18.22,45.84 v17.99,45.84 | v8.55,54.75 6.39,54.75 6.38,54.73 3.05,54.73 2.93,54.86 | 2.93,54.86 3.17,54.61 | R115.1 2.93,54.86 | 2.93,54.86 2.54,55.24
INPUT6  (via drill 1 pad 1.02)
  Top 0.61: -14.29,54.29 v-13.97,54.29
  Top 0.813: v-23.18,63.18 -14.29,54.29
  Bottom 0.406: -4.45,50.16 -3.81,50.8 4.45,50.8 5.08,50.16
  Bottom 0.61: SV1.5 40.96,46.35 31.43,55.88 21.27,55.88 15.56,50.16 5.08,50.16 | v-13.97,54.29 -10.48,50.16 -4.45,50.16 | R116.1 -27.05,65.15 -25.08,63.18 v-23.18,63.18
INPUT7  (via drill 1 pad 1.02, 1 pad 1.27)  (1 unrouted)
  Top 0.61: v-45.09,50.8 -45.09,53.02 -43.81,54.29 -40.96,54.29 -40.01,53.34 -31.37,53.34 -25.02,46.99 v-14.61,46.99 | -22.83,42.89
  Bottom 0.406: -3.17,47.62 -2.54,48.26 3.17,48.26 3.81,47.62
  Bottom 0.61: SV1.8 37.32,39.59 35.76,38.03 28.31,38.03 26.76,39.58 | 26.76,39.58 26.76,39.59 | 26.76,39.58 26.76,39.6 18.73,47.62 3.81,47.62 | v-14.61,46.99 -13.34,47.62 -3.17,47.62 | R117.1 -48.41,49.88 -47.5,50.8 v-45.09,50.8
INPUT8
  Bottom 0.254: 33.43,39.55 35.53,39.55 37.35,41.37 39.08,41.37 39.1,41.35 39.14,41.39 SV1.7
  Bottom 0.406: -3.81,48.9 -3.17,49.53 3.81,49.53 4.45,48.9
  Bottom 0.61: 33.43,39.55 34.06,39.54 28.72,39.54 23.28,44.98 23.28,45.03 23.23,45.03 19.37,48.9 4.45,48.9 | -19.66,44.8 -19.68,44.77 -19.74,44.77 -38.72,25.79 -57.41,25.79 -59.44,27.81 -61.85,27.81 R118.1 | -19.66,44.8 | -19.66,44.8 -15.56,48.9 -3.81,48.9
  Bottom 0.813: -19.66,44.8
INPUT9
  Bottom 0.813: SV8.2 -43.13,-32.43 -58.74,-16.83 -58.74,-2.35 -57.91,-1.52 -56.52,-1.52 R91.1 -56.52,-1.91
INPUT10
  Bottom 0.61: -64.64,-29.84 -64.14,-29.34
  Bottom 0.813: SV8.1 -44.93,-34.76 -51.09,-34.76 -58.8,-27.05 -61.85,-27.05 -64.64,-29.84 -64.62,-29.87 R101.1
INPUT11
  Bottom 0.254: -44.95,-36.74 -44.95,-36.71 -43.09,-34.85 -41.4,-34.85 -41.34,-34.79 | -41.34,-34.79 -41.33,-34.79 | SV8.4 -41.34,-34.79
  Bottom 0.61: -44.95,-36.74 -45.09,-36.88 -45.09,-43.69 -49.91,-48.51 -49.91,-50.8 -49.63,-51.08 R111.1 -49.57,-50.76
INPUT12
  Bottom 0.813: SV8.3 -43.13,-45.13 -29.53,-58.74 -29.53,-62.55 -27.05,-65.02 -27.09,-65.07 R121.1
  Bottom 1.016: R121.1 -27.09,-65.09
INPUT13  (via drill 0.8 pad 1.02)
  Top 0.813: v-7.14,-47.62 -7.11,-47.62 -1.4,-53.34 v-1.27,-53.34
  Bottom 0.813: SV8.6 -33.19,-36.66 -22.23,-47.62 v-7.14,-47.62 | R131.1 0.32,-54.93 v-1.27,-53.34
INPUT14  (via drill 0.8 pad 1.02)
  Top 0.813: v-25.72,-60.01 -15.88,-60.01 -12.7,-63.18 13.34,-63.18 v14.92,-61.59
  Bottom 0.813: v14.92,-61.59 16.83,-59.69 26.92,-59.69 29.84,-62.61 29.85,-62.61 R141.1 | SV8.5 -41.34,-44.39 v-25.72,-60.01
INPUT15  (via drill 0.8 pad 1.02)
  Top 0.813: v41.91,-48.26 40.64,-46.99 34.29,-46.99 33.34,-47.94 v33.34,-50.01
  Bottom 0.61: 151.1 50.16,-47.62
  Bottom 0.813: v33.34,-50.01 32.86,-49.53 -22.86,-49.53 -34.29,-38.1 -37.47,-38.1 -37.78,-38.42 SV8.8 | 151.1 49.53,-48.26 v41.91,-48.26 | 151.1
  Bottom 1.016: 50.16,-47.62 | 151.1 50.16,-47.62 | 50.16,-47.62 50.11,-47.62
INPUT16
  Bottom 0.813: 13.17,-51.28 19.37,-57.78 29.84,-57.78 57.47,-30.16 61.02,-30.16 62.76,-28.43 R161.1 | 13.17,-51.28 13.02,-51.12 | 13.17,-51.28 13.18,-51.28 13.02,-51.12 | 13.17,-51.28 | 13.02,-51.12 -12.86,-51.12 -19.37,-57.78 -24.13,-57.78 -25.89,-56.03 -26.84,-56.03 -39.69,-43.18 -39.69,-40.01 -39.54,-40.15 SV8.7
LAMP1
  Bottom 1.93: F1.1 75.56,6.99 72.39,3.81 L1.2
LAMP2
  Bottom 1.676: 81.27,46.62 81.36,46.45 F2.1
  Bottom 1.93: L2.2 75.99,44.24 81.27,46.62
LAMP3
  Bottom 1.676: 66.67,52.7 66.72,52.75 L3.2
  Bottom 1.93: F3.1 69.98,56.01 66.72,52.75
LAMP4
  Bottom 1.676: 45.09,71.12 45.09,71.23 L4.2
  Bottom 1.93: F4.1 45.09,72.95 45.09,71.23
LAMP5
  Bottom 1.676: -6.67,74.93 -6.67,74.76 F5.1
  Bottom 1.93: L5.2 -6.67,71.48 -6.67,74.76
LAMP6
  Bottom 1.676: -45.4,79.69 -45.4,79.73 F6.1
  Bottom 1.93: L6.2 -43.23,79.69 -45.4,79.69
LAMP7
  Bottom 1.676: -70.48,57.78 -70.41,57.71 F7.1
  Bottom 1.778: L7.2 -61.59,54.93
  Bottom 1.93: -61.59,54.93 -67.63,54.93 -70.41,57.71
LAMP8
  Bottom 1.676: -76.61,27.3 -76.52,27.3 | L8.2 -76.61,27.3 | F8.1 -84.03,27.3 -76.61,27.3
  Bottom 1.778: L8.2 -76.83,27.3
LAMP9
  Bottom 1.676: L9.2 -69.71,-5.08
  Bottom 1.93: -69.71,-5.08 F9.1
LAMP10
  Bottom 1.676: -74.61,-39.69 -74.59,-39.69 L10.2 -74.49,-39.88
  Bottom 1.93: F10.1 -79.38,-46.99 -75.25,-44.77 -74.49,-39.88
LAMP11
  Bottom 1.676: -54.61,-64.77 -54.72,-64.77 L11.2
  Bottom 1.778: L11.2 -54.61,-64.77
  Bottom 1.93: F11.1 -54.61,-67.57 -54.61,-64.77
LAMP12
  Bottom 1.676: -26.99,-79.69 -27.07,-79.69 L12.2
  Bottom 1.93: F12.1 -26.99,-86.07 -26.99,-79.69
LAMP13
  Bottom 1.676: L13.2 -11.43,-67.63 | -11.43,-75.39 F13.1
  Bottom 1.93: -11.43,-67.63 -11.43,-75.39
LAMP14
  Bottom 1.676: 24.13,-80.01 24.17,-79.97 L14.2
  Bottom 1.93: F14.1 24.73,-83.24 24.13,-80.01
LAMP15
  Bottom 1.676: 55.27,-72.42 F15.1
  Bottom 1.778: L15.2 50.8,-65.72
  Bottom 1.93: 50.8,-65.72 50.8,-67.94 55.27,-72.42
LAMP16
  Bottom 1.676: F16.1 76.51,-47.95 76.52,-47.94 73.34,-44.77 69.53,-44.77
  Bottom 1.778: L16.2 69.53,-44.77
N$1
  Bottom 1.676: 65.72,23.18 65.69,23.18 K2.1
  Bottom 1.778: L2.1 80.33,28.89 79.38,29.21
  Bottom 1.93: 79.38,29.21 R2.2 | L2.1 77.47,26.6 77.47,18.73 75.56,16.83 68.26,16.83 65.72,19.37 65.72,23.18
N$2
  Bottom 1.676: K1.1 53.34,-11.11
  Bottom 1.93: 53.34,-11.11 56.83,-14.61 66.04,-14.61 L1.1 64.45,-9.21 64.45,5.4 67.31,8.26 R1.1
N$3
  Bottom 1.676: 56.52,8.13 R1.2
  Bottom 1.93: C1.2 56.52,8.13
N$4
  Bottom 1.676: 67.63,40.96 67.63,40.78 C2.2 | 69.53,22.23 69.45,22.23 69.22,21.99
  Bottom 1.93: R2.1 69.22,21.99 | 67.63,40.78 69.53,38.88 69.53,22.23
N$5
  Bottom 1.676: 87.12,52.63 87.15,52.86
  Bottom 1.778: X5.B8 98.11,15.56
  Bottom 1.93: F4.2 37.15,89.22 54.36,82.41 56.07,81.69 63.13,77.22 62.83,72.59 71.5,64.61 76.12,65.94 77.14,65.32 87.15,52.86 | 98.11,15.56 98.11,26.35 97.95,27.78 96.43,31.56 89.97,33.25 86.84,42.3 89.76,47.37 87.12,52.63
N$6
  Bottom 1.676: R3.2 54.59,64.14 54.93,64.14 54.93,64.33 L3.1 | 54.93,41.59 54.85,41.59 K3.1
  Bottom 1.93: 54.93,41.59 54.93,64.33
N$8
  Bottom 1.676: C3.2
  Bottom 1.93: R3.1 43.58,58.74 C3.2
N$9
  Bottom 1.778: F1.2 76.83,-14.29
  Bottom 1.93: 76.83,-14.29 X5.B2
N$10
  Bottom 1.676: X5.B4 97.65,-4.62
  Bottom 1.778: 90,25.75 F2.2 89.92,25.82
  Bottom 1.93: 89.92,25.82 83.19,20.64 83.19,-1.23 86.58,-4.62 97.65,-4.62
N$11
  Bottom 1.676: 27.73,71.12 C4.2
  Bottom 1.93: R4.1 24.98,71.12 27.73,71.12
N$12
  Bottom 1.676: 29.84,77.47 29.84,77.56 L4.1 29.84,77.59 29.84,77.79 30.16,77.79 | 25.83,77.47 R4.2 | K4.1 37.15,58.53
  Bottom 1.93: 29.84,77.47 25.83,77.47 | 37.15,58.53 37.15,70.8 30.16,77.79
N$13
  Bottom 1.676: R5.2 -5.48,63.5 | 14.29,66.04 14.29,66.67 14.37,66.67 L5.1 14.61,66.72 14.61,66.04
  Bottom 1.93: -5.48,63.5 11.75,63.5 14.29,66.04 | K5.1 17.14,55.26 17.14,63.5 14.61,66.04
N$15
  Bottom 1.676: R5.1 -5.71,52.61 | -0.95,60.33 C5.2
  Bottom 1.93: -5.71,52.61 -5.4,53.34 -0.95,57.78 -0.95,60.33
N$16
  Bottom 1.676: 84.69,51.03 84.77,51.12 | 56.77,72.99 F3.2 57.01,72.84
  Bottom 1.93: X5.B6 88.27,5.4 88.27,19.05 94.67,24.05 93.95,28.77 92,29.59 88.2,30.11 83.43,42.84 86.17,47.09 84.69,51.03 | 84.77,51.12 79.22,57.47 75.49,62.5 69.62,60.38 57.01,72.84
N$17
  Top 1.676: -23.34,68.74 -23.18,68.9 | -16.31,67.11 K6.1 | -23.5,68.9 -23.34,68.74 | -23.34,68.74
  Top 1.93: R6.2 -34.04,63.43 -31.43,66.04 -26.35,66.04 -23.5,68.9 -22.63,69.77 L6.1 | -23.18,68.9 -18.1,68.9 -16.31,67.11
N$18
  Bottom 1.676: -33.02,68.87 -33.02,68.9 -33.2,68.71 C6.2
  Bottom 1.93: R6.1 -35.4,71.28 -33.02,68.9
N$19
  Bottom 1.676: F5.2 15.56,74.61 14.92,75.25
  Bottom 1.778: 14.92,98.42 X6.B2
  Bottom 1.93: 14.92,98.42 14.92,87.63 14.92,75.25
N$20
  Bottom 1.676: -18.76,99.22 -18.73,99.06
  Bottom 1.778: -74.61,59.69 -77.15,57.16
  Bottom 1.93: -74.61,59.69 -56.48,78.57 -53.66,85.09 -44.64,88.39 -40.36,86.28 -31.58,90.57 -30.27,94.7 -18.76,99.22 | -18.73,99.06 X6.B8 | -77.15,57.16 F8.2
N$21
  Bottom 1.676: C7.2 -55.8,50.88
  Bottom 1.93: R7.1 -57.33,49.35 -55.8,50.88
N$22
  Top 1.676: -55.24,46.67 -55.24,46.35 | K7.1 -39.1,55.93 -39.69,56.52 | -46.67,56.2 -46.35,55.88 -46.04,55.88
  Top 1.93: R7.2 -52.25,43.04 -55.24,46.35 | -55.24,46.67 -46.04,55.88 -45.09,56.52 -39.69,56.52 | -39.1,55.93 -39.05,55.88 | L7.1 -49.69,59.21 -46.67,56.2
N$23
  Top 1.676: -63.02,32.54
  Top 1.93: L8.1 -70.31,41.42 -63.02,32.54 | R8.2 -63.01,20.14 -64.77,21.91 -64.77,30.8 -63.02,32.54 | K8.1 -58.78,36.78 -63.02,32.54
N$24
  Bottom 1.676: C8.2 -68.61,25.75 -68.58,25.72 -70.47,23.83 R8.1
N$25
  Bottom 1.676: -50.48,82.55 -45.28,84.53 -41.05,82.37 -28.95,87.41 -27.35,92.2 -23.59,93.99 -23.5,93.98
  Bottom 1.778: F7.2 -52.39,78.11 -50.48,82.55 | -23.5,93.98 -18.41,88.27 -7.94,88.27 | X6.B6 -5.08,98.11 -5.08,91.44
  Bottom 1.93: -7.94,88.27 -5.08,91.44
N$26
  Bottom 1.778: F6.2 -24.45,87.95
  Bottom 1.93: X6.B4 5.08,87.63 1.27,83.82 -19.68,83.82 -24.45,87.95
N$27
  Bottom 1.016: R112.2 | R112.2 61.91,35.88 60.96,34.92 60.64,34.92 60.64,34.8 K2.3
N$28
  Bottom 1.016: K3.3 45.78,50.48 45.72,50.48 45.72,50.87 R113.2
N$29
  Bottom 1.016: K4.3 26.09,62.55 26.04,62.55 26.04,64.59 R114.2
N$30
  Bottom 0.813: K5.3 1.55,52.42 0.95,53.02 0.95,54.93 1,54.88 R115.2
N$31
  Bottom 0.813: K6.3 -28.25,62.23 -28.82,62.79 R116.2
N$32
  Bottom 0.813: K7.3 -48.24,47.31 -48.84,47.31 R117.2
N$33
  Bottom 0.813: R118.2 | R118.2 | K8.3 -61.49,26.04 R118.2
N$34
  Bottom 1.016: R119.2 54.92,1.59 K1.3
N$36
  Bottom 1.016: R101.2 -63.72,-31.43 -62.23,-30.8 -61.91,-30.48 -61.91,-30.11 K10.3
N$38
  Bottom 0.305: R111.2 -48.26,-52.39 -46.84,-50.96 K11.3
N$40
  Bottom 1.016: K12.3 -24.94,-63.5 -24.77,-63.5 -24.77,-64.57 R121.2
N$42
  Bottom 0.813: R131.2 2.22,-53.66 K13.3
N$44
  Bottom 0.813: R141.2 31.75,-61.67 31.43,-61.59 30.48,-59.69 30.48,-59.73 K14.3
N$46
  Bottom 1.016: K15.3 49.53,-45.04 49.53,-45.09 50.05,-45.09 151.2
N$48
  Bottom 0.813: K16.3 60.97,-26.04 62.87,-26.04 R161.2
N$50
  Bottom 1.016: R91.2 -53.98,-3.49 K9.3
N$59
  Bottom 1.676: -52.34,-9.47 R9.1 | -67.31,11.75 L9.1 | -53.66,10.16 K9.1
  Bottom 1.93: -52.34,-9.47 -51.12,-8.26 -51.12,7.62 K9.1 | -67.31,11.75 -66.04,13.02 -55.24,13.02 -53.66,10.16
N$60
  Bottom 1.676: -62.01,-5.3 -61.91,-5.4
  Bottom 1.93: R9.2 -64.21,-9.6 -61.91,-7.3 -61.91,-5.4 | C9.2 -62.01,-5.3
N$61
  Bottom 1.676: K10.1 -66.67,-18.1 -76.83,-18.1 -80.64,-21.91 -80.64,-24.38 L10.1 -80.81,-24.6 -75.88,-29.53 -70.48,-29.53 -63.59,-36.43 R10.2
N$62
  Bottom 1.676: R10.1 -70.28,-41.27 -70.17,-41.27 -70.17,-37.15 -68.57,-35.55 C10.2
N$63
  Bottom 1.676: -55.88,-52.7 -56.13,-52.95 | K11.1 -56.08,-41.79 -56.2,-41.91 -55.88,-42.23
  Bottom 1.93: R11.2 -42.3,-55.88 -52.7,-55.88 -55.88,-52.7 -55.88,-42.23 | -56.13,-52.95 L11.1
N$64
  Bottom 1.676: -49.21,-62.87 -49.21,-62.85 R11.1
  Bottom 1.93: C11.2 -49.21,-60.77 -49.21,-62.85
N$65
  Bottom 1.676: -25.4,-72.07 -25.4,-72.12 C12.2
  Bottom 1.93: R12.1 -25.4,-74.04 -25.4,-72.12
N$66
  Bottom 1.676: L12.1 -42.35,-73.34 | -36.51,-58.83 K12.1 | -31.11,-68.9 -31.11,-69.22
  Bottom 1.93: R12.2 -21.09,-68.9 -31.11,-68.9 -36.51,-63.5 -36.51,-58.83 | L12.1 -35.23,-73.33 -31.11,-69.22
N$67
  Bottom 1.676: -11.43,-53.34 K13.1
  Bottom 1.93: -11.43,-53.34 -14.29,-56.2 -14.29,-62.55 -12.06,-64.77 2.54,-64.77 L13.1 6.67,-67.63 R13.2
N$68
  Bottom 1.93: C13.2 8.89,-56.39 R13.1
N$69
  Bottom 1.676: 39.37,-73.66 39.38,-73.65 L14.1
  Bottom 1.93: K14.1 20.5,-64.64 29.53,-73.66 39.37,-73.66 40.49,-72.54 R14.2
N$70
  Bottom 1.676: 35.56,-66.03 C14.2 | 39.05,-60.96 39.16,-60.85 R14.1
  Bottom 1.778: R14.1 39.05,-60.64
  Bottom 1.93: 35.56,-66.03 39.05,-62.55 39.05,-60.96
N$71
  Bottom 1.676: R15.1 56.97,-42.69 57.47,-43.18
  Bottom 1.93: C15.2 57.47,-49.53 57.47,-43.18 | 56.97,-42.69 56.83,-42.55
N$72
  Bottom 1.676: 62.55,-54.29 62.54,-54.28 L15.1 62.54,-53.98
  Bottom 1.93: K15.1 62.17,-53.91 62.54,-54.28 | R15.2 64.86,-51.67 62.54,-53.98
N$73
  Bottom 1.676: 75.88,-29.53 75.85,-29.5 L16.1 | 75.56,-29.53 75.6,-29.5 L16.1 | R16.2 79.06,-25.71 | 75.56,-29.21 75.74,-29.38 L16.1
  Bottom 1.93: K16.1 61.05,-37.69 64.45,-34.29 71.12,-34.29 75.88,-29.53 | 75.56,-29.21 79.06,-25.71
N$74
  Bottom 1.676: 67.31,-20.64 67.52,-20.85 R16.1
  Bottom 1.778: C16.2 69.53,-26.35
  Bottom 1.93: 69.53,-26.35 69.53,-22.86 67.52,-20.85
N$139  (1 unrouted)
  Bottom 1.676: F12.2 -49.24,-79.03 -49.21,-79.06 -49.46,-79.05 | -98.11,-22.54 -98.13,-22.58
  Bottom 1.778: -49.21,-79.06 F12.2
  Bottom 1.93: -99.06,-16.83 -98.11,-22.54 | -49.46,-79.05 -59,-79.71 -62.6,-76.31 -63.17,-68.51 -70.58,-61 -76.41,-63.16 -84.14,-55.56 -89.98,-45.37 -85.64,-40.84 -88.93,-33.91 -94.08,-33.65 -98.13,-22.58
N$140
  Bottom 1.778: -98.74,13.02 X2.B2
  Bottom 1.93: F9.2 -78.42,13.02 -98.74,13.02
N$141
  Bottom 1.676: F10.2 -86.99,-26.35 -83.5,-22.86 | -98.74,3.17 -98.66,3.09 X2.B4
  Bottom 1.93: -83.5,-22.86 -83.5,0.95 -85.72,3.17 -98.74,3.17
N$142
  Bottom 1.676: -93.98,-24.13 -94.08,-24.01
  Bottom 1.93: X2.B6 -87.95,-6.99 -86.68,-8.57 -86.68,-14.29 -90.81,-22.54 -93.98,-24.13 | F11.2 -75.25,-55.88 -78.11,-55.88 -82.23,-51.75 -84.56,-46.72 -80.9,-43.33 -86.64,-29.95 -91.93,-30.15 -94.08,-24.01
N$143
  Bottom 1.676: -13.34,-97.46 X3.B2
  Bottom 1.93: F13.2 -2.86,-75.56 -13.34,-85.72 -13.34,-97.46
N$144
  Bottom 1.676: 78.96,-58.77 79.06,-58.42
  Bottom 1.778: 85.09,-26.99 F16.2
  Bottom 1.93: X3.B8 26.37,-96.35 27.88,-96.25 30.02,-95.91 33.13,-89.47 41.24,-86.72 50.28,-87.58 54.61,-84.14 60.33,-79.06 65.24,-74.03 63.06,-68.55 70.76,-61.57 78.96,-58.77 | 79.06,-58.42 88.58,-33.02 85.09,-26.99
N$145
  Bottom 1.676: 71.22,-56.41 F15.2
  Bottom 1.93: X3.B6 6.67,-89.22 8.57,-87.31 19.72,-87.12 22.6,-92.83 27.63,-92.7 30.45,-87.06 41.96,-83.11 48.39,-84.28 51.63,-81.93 53.74,-80.41 57.15,-77.15 60.98,-73.04 58.89,-67.92 71.22,-56.41
N$146
  Bottom 1.676: -3.49,-97.49 X3.B4 | F14.2 45.23,-79.21 | F14.2 44.34,-79.58 | 27.3,-76.52 29.53,-78.74 45.72,-78.74 45.72,-79.48 F14.2
  Bottom 1.778: F14.2 45.78,-79.55
  Bottom 1.93: -3.49,-97.49 -3.49,-88.58 3.17,-81.92 13.02,-81.92 18.41,-76.52 27.3,-76.52
(copper drawn outside any net)
  shapes: Bottom circle x1, Top circle x1

### Text on the board
tNames: L8 | L7 | L6 | L5 | B | INPUT1 | AC2 | AC1 | A | L9 | L4 | L10 | L3 | L11 | L2 | L12 | L1 | C | INPUT2 | DISKO3200 (rev.b) / 2011 | designed by nakednindza | nakednindza@pravi.me | D | L13 | L14 | L15 | L16